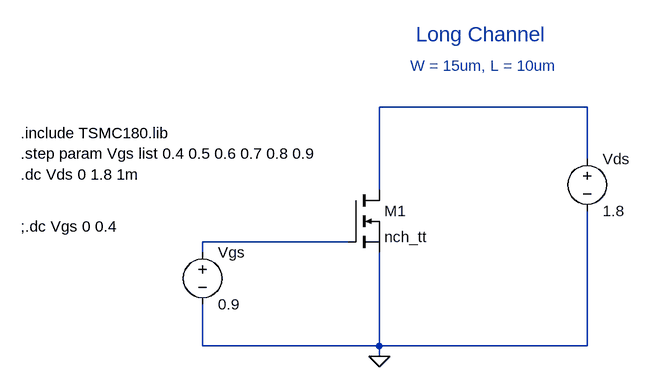
[diagram p0: schematic Q4_nmos_lc.asc]
Q4_nmos_lc.asc, the LTspice schematic file:
Version 4
SHEET 1 880 680
WIRE 608 16 288 16
WIRE 608 96 608 16
WIRE 288 144 288 16
WIRE 240 224 16 224
WIRE 16 240 16 224
WIRE 16 384 16 320
WIRE 288 384 288 240
WIRE 288 384 16 384
WIRE 608 384 608 176
WIRE 608 384 288 384
WIRE 288 400 288 384
FLAG 288 400 0
SYMBOL voltage 16 224 R0
WINDOW 123 0 0 Left 0
WINDOW 39 0 0 Left 0
SYMATTR InstName Vgs
SYMATTR Value 0.9
SYMBOL nmos 240 144 R0
SYMATTR InstName M1
SYMATTR Value nch_tt
SYMATTR Value2 l=10u w=15u
SYMBOL voltage 608 80 R0
WINDOW 123 0 0 Left 0
WINDOW 39 0 0 Left 0
SYMATTR InstName Vds
SYMATTR Value 1.8
TEXT -264 56 Left 2 !.include TSMC180.lib
TEXT -264 88 Left 2 !.step param Vgs list 0.4 0.5 0.6 0.7 0.8 0.9
TEXT -264 120 Left 2 !.dc Vds 0 1.8 1m
TEXT -264 200 Left 2 !;.dc Vgs 0 0.4
TEXT 344 -96 Left 3 ;Long Channel
TEXT 336 -48 Left 2 ;W = 15um, L = 10um

The netlist it stands for:
* Q4_nmos_lc.asc
Vgs N002 0 0.9
M1 N001 N002 0 0 nch_tt l=10u w=15u
Vds N001 0 1.8
.model NMOS NMOS
.model PMOS PMOS
.lib standard.mos
.include TSMC180.lib
.step param Vgs list 0.4 0.5 0.6 0.7 0.8 0.9
.dc Vds 0 1.8 1m
;.dc Vgs 0 0.4
* Long Channel
* W = 15um, L = 10um
.backanno
.end